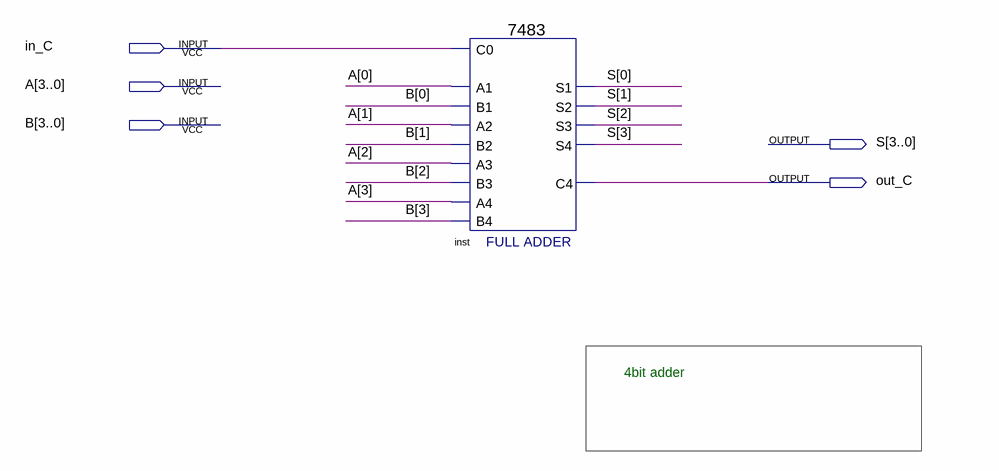
[diagram p0: schematic sheet]
// Quartus schematic b4bit.bdf as structural Verilog: 1 symbols, 5 pins
module b4bit (
  input  in_C,
  input  [3:0] A,
  input  [3:0] B,
  output [3:0] S,
  output out_C
);

  \7483  inst (
    .B4(B[3]), .C0(in_C), .A1(A[0]), .A2(A[1]), .B1(B[0]), .B2(B[1]), .A3(A[2]), .B3(B[2]), .A4(A[3]),
    .S3(S[2]), .S4(S[3]), .S2(S[1]), .C4(out_C), .S1(S[0]));

  // Notes on the sheet:
  //   4bit adder
endmodule
